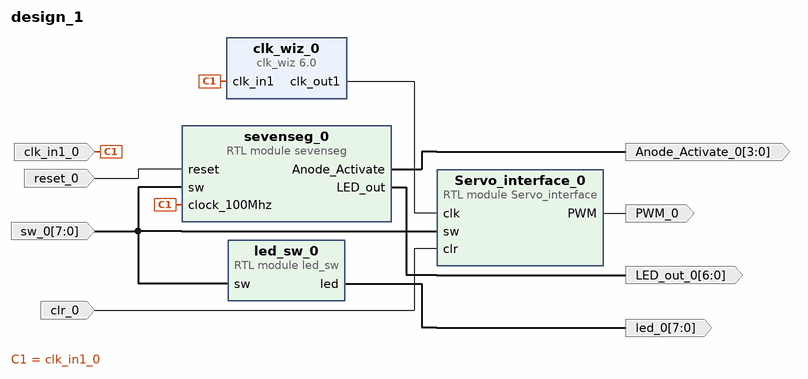
[diagram p0: block diagram of the top level]
# Vivado block design design_1, xc7a35tcpg236-1, Vivado 2018.3
create_bd_design design_1

create_bd_port -dir I -type clk clk_in1_0
create_bd_port -dir I clr_0
create_bd_port -dir I -from 7 -to 0 sw_0
create_bd_port -dir O PWM_0
create_bd_port -dir O -from 6 -to 0 LED_out_0
create_bd_port -dir O -from 3 -to 0 Anode_Activate_0
create_bd_port -dir I -type rst reset_0
create_bd_port -dir O -from 7 -to 0 led_0

create_bd_cell -type ip -vlnv xilinx.com:ip:clk_wiz:6.0 clk_wiz_0
set_property -dict [list \
  CONFIG.CLKIN1_JITTER_PS 100.0 \
  CONFIG.CLKOUT1_JITTER 151.636 \
  CONFIG.CLKOUT1_PHASE_ERROR 98.575 \
  CONFIG.CLKOUT1_REQUESTED_OUT_FREQ 50 \
  CONFIG.MMCM_CLKFBOUT_MULT_F 10.000 \
  CONFIG.MMCM_CLKIN1_PERIOD 10.000 \
  CONFIG.MMCM_CLKIN2_PERIOD 10.000 \
  CONFIG.MMCM_CLKOUT0_DIVIDE_F 20.000 \
  CONFIG.MMCM_DIVCLK_DIVIDE 1 \
  CONFIG.PRIM_IN_FREQ 100 \
  CONFIG.USE_LOCKED false \
  CONFIG.USE_RESET false \
] [get_bd_cells clk_wiz_0]
create_bd_cell -type module -reference sevenseg sevenseg_0
create_bd_cell -type module -reference led_sw led_sw_0
create_bd_cell -type module -reference Servo_interface Servo_interface_0

# ---- connections ----

connect_bd_net [get_bd_pins clk_wiz_0/clk_out1] [get_bd_pins Servo_interface_0/clk]
connect_bd_net -net clk_in1_0_1 [get_bd_ports clk_in1_0] [get_bd_pins clk_wiz_0/clk_in1] [get_bd_pins sevenseg_0/clock_100Mhz]
connect_bd_net -net clr_0_1 [get_bd_ports clr_0] [get_bd_pins Servo_interface_0/clr]
connect_bd_net -net sw_0_1 [get_bd_ports sw_0] [get_bd_pins sevenseg_0/sw] [get_bd_pins led_sw_0/sw] [get_bd_pins Servo_interface_0/sw]
connect_bd_net [get_bd_pins Servo_interface_0/PWM] [get_bd_ports PWM_0]
connect_bd_net [get_bd_pins sevenseg_0/LED_out] [get_bd_ports LED_out_0]
connect_bd_net [get_bd_pins sevenseg_0/Anode_Activate] [get_bd_ports Anode_Activate_0]
connect_bd_net -net reset_0_1 [get_bd_ports reset_0] [get_bd_pins sevenseg_0/reset]
connect_bd_net [get_bd_pins led_sw_0/led] [get_bd_ports led_0]

validate_bd_design
save_bd_design
